# Altium project Body.PrjPcb
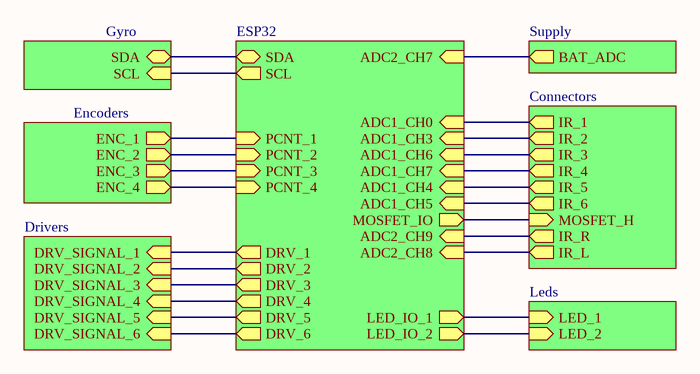
[diagram p0: Body.SchDoc]
8 sheets, 53 parts. Net scope: hierarchical (ports join the sheet entries above them; power ports are global).
Board file: Body.PcbDoc
Sheets:
  Body.SchDoc
    ESP32 = ESP32.SchDoc
    Gyro = Gyro.SchDoc
    Leds = Leds.SchDoc
    Connectors = Connectors.SchDoc
    Supply = Supply.SchDoc
    Drivers = Drivers.SchDoc
    Encoders = Encoders.SchDoc

## Sheet Body.SchDoc
size A4; SheetNumber: 1; SheetTotal: 8

### Sub-sheets
Connectors = Connectors: MOSFET_H (in), IR_1 (out), IR_2 (out), IR_3 (out), IR_4 (out), IR_5 (out), IR_6 (out), IR_R (out), IR_L (out)
Drivers = Drivers: DRV_SIGNAL_1 (in), DRV_SIGNAL_2 (in), DRV_SIGNAL_3 (in), DRV_SIGNAL_4 (in), DRV_SIGNAL_5 (in), DRV_SIGNAL_6 (in)
Encoders = Encoders: ENC_1 (out), ENC_2 (out), ENC_3 (out), ENC_4 (out)
ESP32 = ESP32: ADC1_CH0 (in), ADC1_CH3 (in), ADC1_CH4 (in), ADC1_CH5 (in), ADC1_CH6 (in), ADC1_CH7 (in), MOSFET_IO (out), DRV_1 (out), DRV_2 (out), DRV_3 (out), DRV_4 (out), DRV_5 (out), DRV_6 (out), SCL (out), SDA (bidir), ADC2_CH8 (in), PCNT_1 (in), PCNT_2 (in), PCNT_3 (in), PCNT_4 (in), LED_IO_1 (out), LED_IO_2 (out), ADC2_CH7 (in), ADC2_CH9 (in)
Gyro = Gyro: SDA (bidir), SCL (in)
Leds = Leds: LED_1 (in), LED_2 (in)
Supply = Supply: BAT_ADC (out)

### Nets
SCL: sheet ESP32/SCL, sheet Gyro/SCL
SDA: sheet ESP32/SDA, sheet Gyro/SDA
NetD4_A: sheet ESP32/LED_IO_1, sheet Leds/LED_1
NetD6_A: sheet ESP32/LED_IO_2, sheet Leds/LED_2
NetJ1_3: sheet ESP32/ADC1_CH5, sheet Connectors/IR_6
NetJ1_4: sheet ESP32/ADC1_CH4, sheet Connectors/IR_5
NetJ1_5: sheet ESP32/ADC1_CH7, sheet Connectors/IR_4
NetJ1_6: sheet ESP32/ADC1_CH6, sheet Connectors/IR_3
NetJ1_7: sheet ESP32/ADC1_CH3, sheet Connectors/IR_2
NetJ1_8: sheet ESP32/ADC1_CH0, sheet Connectors/IR_1
NetJ2_3: sheet ESP32/ADC2_CH8, sheet Connectors/IR_L
NetJ3_3: sheet ESP32/ADC2_CH9, sheet Connectors/IR_R
NetJ7_PIN1: sheet ESP32/DRV_4, sheet Drivers/DRV_SIGNAL_4
NetJ8_PIN1: sheet ESP32/DRV_1, sheet Drivers/DRV_SIGNAL_1
NetJ9_PIN1: sheet ESP32/DRV_5, sheet Drivers/DRV_SIGNAL_5
NetJ10_PIN1: sheet ESP32/DRV_2, sheet Drivers/DRV_SIGNAL_2
NetJ11_PIN1: sheet ESP32/DRV_6, sheet Drivers/DRV_SIGNAL_6
NetJ12_PIN1: sheet ESP32/DRV_3, sheet Drivers/DRV_SIGNAL_3
NetR1_1: sheet ESP32/MOSFET_IO, sheet Connectors/MOSFET_H
NetR3_1: sheet ESP32/ADC2_CH7, sheet Supply/BAT_ADC
NetR15_1: sheet ESP32/PCNT_1, sheet Encoders/ENC_1
NetR16_1: sheet ESP32/PCNT_2, sheet Encoders/ENC_2
NetR17_1: sheet ESP32/PCNT_3, sheet Encoders/ENC_3
NetR18_1: sheet ESP32/PCNT_4, sheet Encoders/ENC_4

## Sheet ESP32.SchDoc
size A4; SheetNumber: 5; SheetTotal: 8
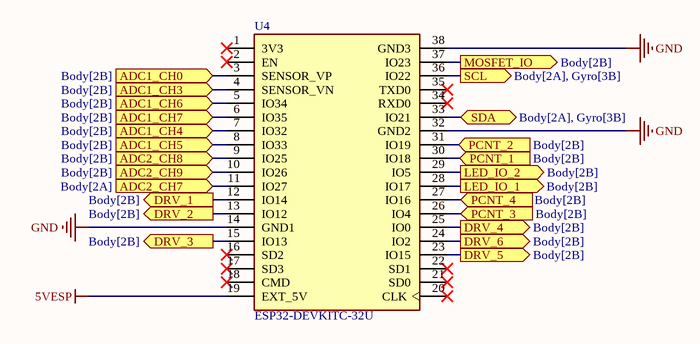
[diagram p1: ESP32.SchDoc]

### Parts
U4  ESP32-DEVKITC-32U  [MODULE_ESP32-DEVKITC-32U]

### Ports
ADC1_CH0 (in, see Body[2B]), ADC1_CH3 (in, see Body[2B]), ADC1_CH4 (in, see Body[2B]), ADC1_CH5 (in, see Body[2B]), ADC1_CH6 (in, see Body[2B]), ADC1_CH7 (in, see Body[2B]), ADC2_CH7 (in, see Body[2A]), ADC2_CH8 (in, see Body[2B]), ADC2_CH9 (in, see Body[2B]), DRV_1 (out, see Body[2B]), DRV_2 (out, see Body[2B]), DRV_3 (out, see Body[2B]), DRV_4 (out, see Body[2B]), DRV_5 (out, see Body[2B]), DRV_6 (out, see Body[2B]), LED_IO_1 (out, see Body[2B]), LED_IO_2 (out, see Body[2B]), MOSFET_IO (out, see Body[2B]), PCNT_1 (in, see Body[2B]), PCNT_2 (in, see Body[2B]), PCNT_3 (in, see Body[2B]), PCNT_4 (in, see Body[2B]), SCL (out, see Body[2A], Gyro[3B]), SDA (bidir, see Body[2A], Gyro[3B])

### Nets
5VESP: U4.19(EXT_5V)
GND: U4.14(GND1) U4.32(GND2) U4.38(GND3)
SCL: U4.36(IO22) ; port SCL
SDA: U4.33(IO21) ; port SDA
NetD4_A: U4.28(IO17) ; port LED_IO_1
NetD6_A: U4.29(IO5) ; port LED_IO_2
NetJ1_3: U4.8(IO33) ; port ADC1_CH5
NetJ1_4: U4.7(IO32) ; port ADC1_CH4
NetJ1_5: U4.6(IO35) ; port ADC1_CH7
NetJ1_6: U4.5(IO34) ; port ADC1_CH6
NetJ1_7: U4.4(SENSOR_VN) ; port ADC1_CH3
NetJ1_8: U4.3(SENSOR_VP) ; port ADC1_CH0
NetJ2_3: U4.9(IO25) ; port ADC2_CH8
NetJ3_3: U4.10(IO26) ; port ADC2_CH9
NetJ7_PIN1: U4.25(IO0) ; port DRV_4
NetJ8_PIN1: U4.12(IO14) ; port DRV_1
NetJ9_PIN1: U4.23(IO15) ; port DRV_5
NetJ10_PIN1: U4.13(IO12) ; port DRV_2
NetJ11_PIN1: U4.24(IO2) ; port DRV_6
NetJ12_PIN1: U4.15(IO13) ; port DRV_3
NetR1_1: U4.37(IO23) ; port MOSFET_IO
NetR3_1: U4.11(IO27) ; port ADC2_CH7
NetR15_1: U4.30(IO18) ; port PCNT_1
NetR16_1: U4.31(IO19) ; port PCNT_2
NetR17_1: U4.26(IO4) ; port PCNT_3
NetR18_1: U4.27(IO16) ; port PCNT_4

Not connected (* = marked no-connect by the designer): U4 1(3V3)* 2(EN)* 16(SD2)* 17(SD3)* 18(CMD)* 20(CLK)* 21(SD0)* 22(SD1)* 34(RXD0)* 35(TXD0)*

### Library data of the parts
U4 = ESP32-DEVKITC-32U: ESP32-WROOM-32UE series Transceiver; 802.11 b/g/n (Wi-Fi, WiFi, WLAN), Bluetooth® Smart Ready 4.x Dual Mode Evaluation Board; MF: Espressif Systems; SnapEDA_Link: https://www.snapeda.com/parts/ESP32-DEVKITC-32U/Espressif+Systems/view-part/?ref=snap; Package: CUSTOM-38 ESPRESSIF; Value: *; MP: ESP32-DEVKITC-32U; Check_prices: https://www.snapeda.com/parts/ESP32-DEVKITC-32U/Espressif+Systems/view-part/?ref=eda

## Sheet Gyro.SchDoc
size A4 portrait; SheetNumber: 6; SheetTotal: 8
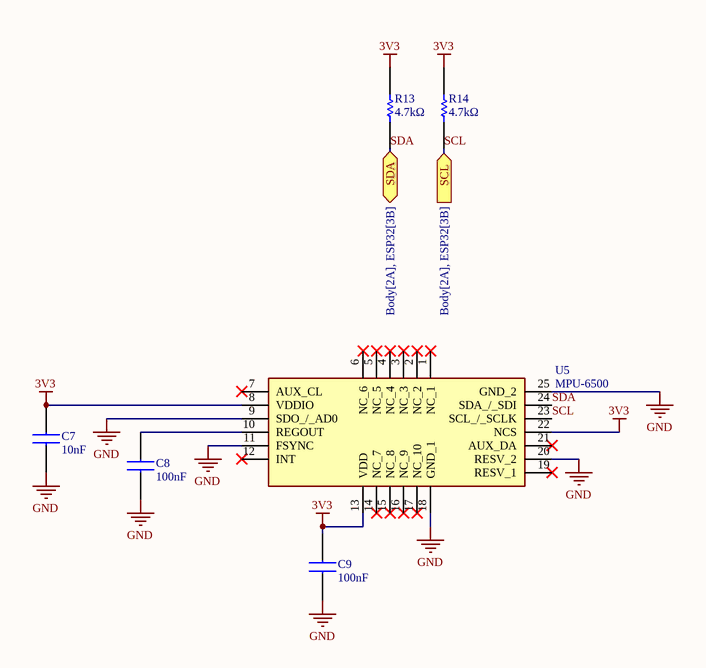
[diagram p2: Gyro.SchDoc]

### Parts
C7  value 10nF  [CAP0805]  (hidden comment: CL21B103KBANNNC)
C8  value 100nF  [CAP0805]  (hidden comment: CC0805KRX7R9BB104)
C9  value 100nF  [CAP0805]  (hidden comment: CC0805KRX7R9BB104)
R13  value 4.7kΩ  [RES0805]  (hidden comment: 0805W8F4701T5E)
R14  value 4.7kΩ  [RES0805]  (hidden comment: 0805W8F4701T5E)
U5  MPU-6500  [QFN-24_L3.0-W3.0-H0.9]

### Ports
SCL (in, see Body[2A], ESP32[3B]), SDA (bidir, see Body[2A], ESP32[3B])

### Nets
3V3: C7.1 C9.1 R13.2 R14.2 U5.8(VDDIO) U5.13(VDD) U5.22(NCS)
GND: C7.2 C8.1 C9.2 U5.9(SDO_/_AD0) U5.11(FSYNC) U5.18(GND_1) U5.20(RESV_2) U5.25(GND_2)
SCL: R14.1 U5.23(SCL_/_SCLK) ; port SCL
SDA: R13.1 U5.24(SDA_/_SDI) ; port SDA
NetC8_2: C8.2 U5.10(REGOUT)

Not connected (* = marked no-connect by the designer): U5 1(NC_1)* 2(NC_2)* 3(NC_3)* 4(NC_4)* 5(NC_5)* 6(NC_6)* 7(AUX_CL)* 12(INT)* 14(NC_7)* 15(NC_8)* 16(NC_9)* 17(NC_10)* 19(RESV_1)* 21(AUX_DA)*

### Library data of the parts
C7 = CL21B103KBANNNC: Multilayer Ceramic Capacitors MLCC - SMD/SMT 50 V 10nF X7R 0805 10%; Manufacturer_Name: YAGEO; Geometry.Height: 0.95mm; Manufacturer_Part_Number: CL21B103KBANNNC; Datasheet Link: https://wmsc.lcsc.com/wmsc/upload/file/pdf/v2/lcsc/2304140030_Samsung-Electro-Mechanics-CL21B103KBANNNC_C1710.pdf; LCSC: C1710
C8 C9 = CC0805KRX7R9BB104: Multilayer Ceramic Capacitors MLCC - SMD/SMT 50 V 0.1uF X7R 0805 10%; Manufacturer_Name: YAGEO; Geometry.Height: 0.95mm; Mouser Part Number: 603-CC805KRX7R9BB104; Mouser Price/Stock: https://www.mouser.co.uk/ProductDetail/YAGEO/CC0805KRX7R9BB104?qs=vTakOoo5QyLx0lXWgVtRhQ%3D%3D; Manufacturer_Part_Number: CC0805KRX7R9BB104; Datasheet Link: https://www.yageo.com/upload/media/product/productsearch/datasheet/mlcc/UPY-GPHC_X7R_6.3V-to-50V_20.pdf; LCSC: C49678
R13 R14 = 0805W8F4701T5E: 125mW Thick Film Resistors 150V ±100ppm/℃ ±1% 4.7kΩ 0805 Chip Resistor - Surface Mount ROHS; Manufacturer_Name: UNI-ROYAL; Geometry.Height: 0.95mm; Manufacturer_Part_Number: 0805W8F4701T5E; Datasheet Link: https://wmsc.lcsc.com/wmsc/upload/file/pdf/v2/lcsc/2206010200_UNI-ROYAL-Uniroyal-Elec-0805W8F4701T5E_C17673.pdf; LCSC: C17673
U5 = MPU-6500: IMUs - Inertial Measurement Units 6-Axis MEMS MotionTracking  Device with DMP; Manufacturer_Name: TDK; Geometry.Height: 0.95mm; LCSC: C50278; Part Number: MPU-6500; ComponentLink1Description: New link; ComponentLink1URL: https://product.tdk.com/system/files/dam/doc/product/sensor/mortion-inertial/imu/data_sheet/mpu-6500-datasheet2.pdf

## Sheet Leds.SchDoc
size A4 portrait; SheetNumber: 7; SheetTotal: 8
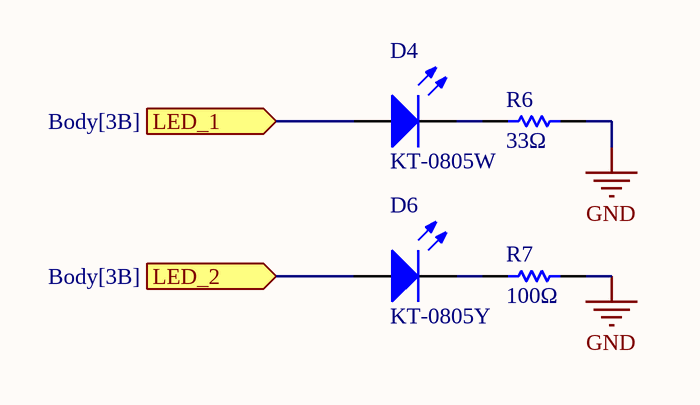
[diagram p3: Leds.SchDoc]

### Parts
D4  KT-0805W  [LED0805]
D6  KT-0805Y  [LED0805]
R6  value 33Ω  [RES0805]  (hidden comment: 0805W8F330JT5E)
R7  value 100Ω  [RES0805]  (hidden comment: 0805W8F1000T5E)

### Ports
LED_1 (in, see Body[3B]), LED_2 (in, see Body[3B])

### Nets
GND: R6.2 R7.2
NetD4_A: D4.A ; port LED_1
NetD4_K: D4.K R6.1
NetD6_A: D6.A ; port LED_2
NetD6_K: D6.K R7.1

### Library data of the parts
D4 = KT-0805W: 0805 LED Indication - Discrete ROHS; Manufacturer: Hubei KENTO Elec; Color: White; Current - Forward (If): 25mA; Voltage - Forward (Vf): 2.8V; LCSC: C34499; Package / Case: 0805; ComponentLink2Description: Datasheet; ComponentLink2URL: https://www.lcsc.com/datasheet/lcsc_datasheet_2305091500_Hubei-KENTO-Elec-KT-0805W_C34499.pdf; ComponentLink3Description: JLCPCB; ComponentLink3URL: https://jlcpcb.com/partdetail/Hubei_KentoElec-KT0805W/C34499
D6 = KT-0805Y: Yellow 0805 LED Indication - Discrete ROHS; Manufacturer: Hubei KENTO Elec; Current - Forward (If): 20mA; Voltage - Forward (Vf): 2.1V; LCSC: C2296; Package / Case: 0805; Color: Yellow; ComponentLink2Description: Datasheet; ComponentLink2URL: https://www.lcsc.com/datasheet/lcsc_datasheet_1806151129_Hubei-KENTO-Elec-KT-0805Y_C2296.pdf
R6 = 0805W8F330JT5E: 125mW Thick Film Resistors 150V ±1% ±200ppm/℃ 33Ω 0805 Chip Resistor - Surface Mount ROHS; Manufacturer_Name: UNI-ROYAL; Geometry.Height: 0.95mm; Part Number: 0805W8F330JT5E; LCSC: C17634; ComponentLink1Description: Datasheet Link; ComponentLink1URL: https://www.lcsc.com/datasheet/lcsc_datasheet_2205311830_UNI-ROYAL-Uniroyal-Elec-0805W8F330JT5E_C17634.pdf
R7 = 0805W8F1000T5E: 125mW Thick Film Resistors 150V ±100ppm/℃ ±1% 100Ω 0805 Chip Resistor - Surface Mount ROHS; Manufacturer_Name: UNI-ROYAL; Geometry.Height: 0.95mm; Manufacturer_Part_Number: 0805W8F1000T5E; Datasheet Link: https://wmsc.lcsc.com/wmsc/upload/file/pdf/v2/lcsc/2206010216_UNI-ROYAL-Uniroyal-Elec-0805W8F1000T5E_C17408.pdf; LCSC: C17408

## Sheet Connectors.SchDoc
size A4 portrait; SheetNumber: 2; SheetTotal: 8
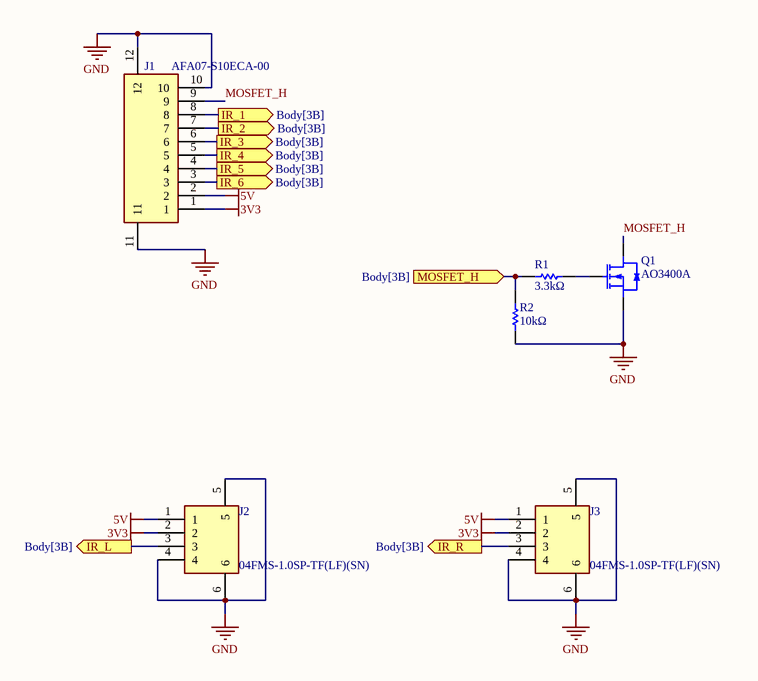
[diagram p4: Connectors.SchDoc]

### Parts
J1  AFA07-S10ECA-00  [FPC-SMD-P1.00-10P_LCS-SJ-H2.5]
J2  04FMS-1.0SP-TF(LF)(SN)  [FPC-SMD-P1.00-4P_JST]
J3  04FMS-1.0SP-TF(LF)(SN)  [FPC-SMD-P1.00-4P_JST]
Q1  AO3400A  [SOT-23]
R1  value 3.3kΩ  [RES0805]  (hidden comment: 0805W8F3301T5E)
R2  value 10kΩ  [RES0805]  (hidden comment: 0805W8F1002T5E)

### Ports
IR_1 (out, see Body[3B]), IR_2 (out, see Body[3B]), IR_3 (out, see Body[3B]), IR_4 (out, see Body[3B]), IR_5 (out, see Body[3B]), IR_6 (out, see Body[3B]), IR_L (out, see Body[3B]), IR_R (out, see Body[3B]), MOSFET_H (in, see Body[3B])

### Nets
3V3: J1.1 J2.2 J3.2
5V: J1.2 J2.1 J3.1
GND: J1.10 J1.11 J1.12 J2.4 J2.5 J2.6 J3.4 J3.5 J3.6 Q1.S R2.1
MOSFET_H: J1.9 Q1.D
NetJ1_3: J1.3 ; port IR_6
NetJ1_4: J1.4 ; port IR_5
NetJ1_5: J1.5 ; port IR_4
NetJ1_6: J1.6 ; port IR_3
NetJ1_7: J1.7 ; port IR_2
NetJ1_8: J1.8 ; port IR_1
NetJ2_3: J2.3 ; port IR_L
NetJ3_3: J3.3 ; port IR_R
NetQ1_G: Q1.G R1.2
NetR1_1: R1.1 R2.2 ; port MOSFET_H

### Library data of the parts
J1 = AFA07-S10ECA-00: Drawer Type 10P Contact,Top Horizontal attachment 1mm SMD,P=1mm,Surface Mount，Right Angle FFC, FPC (Flat Flexible) Connector Assemblies ROHS; Manufacturer_Name: JUSHUO; Geometry.Height: 2.50mm; Manufacturer_Part_Number: AFA07-S10ECA-00; Datasheet Link: https://wmsc.lcsc.com/wmsc/upload/file/pdf/v2/lcsc/2304140030_JUSHUO-AFA07-S10ECA-00_C262737.pdf; LCSC: C262737
J2 J3 = 04FMS-1.0SP-TF(LF)(SN): Drawer Type 4P Dual-sided contacts / top and bottom connection Horizontal attachment 1mm SMD,P=1mm,Surface Mount，Right Angle FFC, FPC (Flat Flexible) Connector Assemblies ROHS; Manufacturer_Name: JST; Geometry.Height: 2.80mm; Manufacturer_Part_Number: 04FMS-1.0SP-TF(LF)(SN); LCSC: C265033; ComponentLink1Description: JLCPCB; ComponentLink1URL: https://jlcpcb.com/partdetail/Jst-04FMS_1_0SP_TF_LF_SN/C265033; ComponentLink2Description: Datasheet; ComponentLink2URL: https://www.lcsc.com/datasheet/lcsc_datasheet_1811061308_JST-04FMS-1-0SP-TF-LF-SN_C265033.pdf
Q1 = AO3400A: 30V 5.7A 26.5mΩ@10V,5.7A 1.4W 1.5V@250uA 1PCSNChannel SOT-23-3L MOSFETs ROHS; Manufacturer: Alpha & Omega Semicon; FET Type: N-Channel; Rds On (Max) @ Id, Vgs: 38 mohm @ 5.7A, 10V; Input Capacitance (Ciss) (Max) @Vds: 630pF; Vgs(th) (Max) Id: 1.5V, Id =250uA; Gate Charge (Qg) (Max) @ Vgs: 7nC @ 4.5V; Vgs (Max): 12 V; Rise / Fall Time (Typ): 2.5 ~ 2.0 (ns); Part Number: AO3400A; Package / Case: SOT-23; Operating Temperature: -55 °C ~150 °C; Drain to Source Voltage (Vds): 30V; Current - Continuous Drain (Id) @25°C: 5.7A; Power Dissipation (Max): 1.4 W; ComponentLink1Description: Datasheet; ComponentLink1URL: https://jlcpcb.com/partdetail/Alpha_OmegaSemicon-AO3400A/C20917; LCSC: C20917
R1 = 0805W8F3301T5E: 125mW Thick Film Resistors 150V ±100ppm/℃ ±1% 3.3kΩ 0805 Chip Resistor - Surface Mount ROHS; Manufacturer_Name: UNI-ROYAL; Geometry.Height: 0.95mm; Manufacturer_Part_Number: 0805W8F3301T5E; Datasheet Link: https://wmsc.lcsc.com/wmsc/upload/file/pdf/v2/lcsc/2206010045_UNI-ROYAL-Uniroyal-Elec-0805W8F3301T5E_C26010.pdf; LCSC: C26010
R2 = 0805W8F1002T5E: 125mW Thick Film Resistors 150V ±100ppm/℃ ±1% 10kΩ 0805 Chip Resistor - Surface Mount ROHS; Manufacturer_Name: UNI-ROYAL; Geometry.Height: 0.95mm; Manufacturer_Part_Number: 0805W8F1002T5E; Datasheet Link: https://wmsc.lcsc.com/wmsc/upload/file/pdf/v2/lcsc/2206010216_UNI-ROYAL-Uniroyal-Elec-0805W8F1002T5E_C17414.pdf; LCSC: C17414

## Sheet Supply.SchDoc
size A4; SheetNumber: 8; SheetTotal: 8
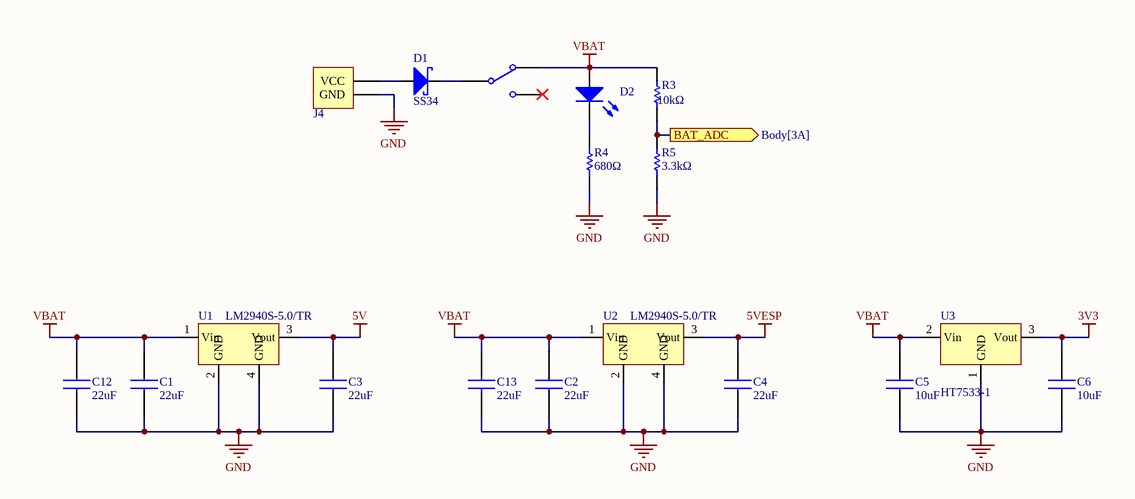
[diagram p5: Supply.SchDoc]

### Parts
C1  value 22uF  [CAP0805]  (hidden comment: CL21A226MAQNNNE)
C2  value 22uF  [CAP0805]  (hidden comment: CL21A226MAQNNNE)
C3  value 22uF  [CAP0805]  (hidden comment: CL21A226MAQNNNE)
C4  value 22uF  [CAP0805]  (hidden comment: CL21A226MAQNNNE)
C5  value 10uF  [CAP0805]  (hidden comment: GRM21BR61H106KE43L)
C6  value 10uF  [CAP0805]  (hidden comment: GRM21BR61H106KE43L)
C12  value 22uF  [CAP0805]  (hidden comment: CL21A226MAQNNNE)
C13  value 22uF  [CAP0805]  (hidden comment: CL21A226MAQNNNE)
D1  SS34  [SMA_L4.3-W2.6-LS5.2-RD]
D2  KT-0805G  [LED0805]  (value not drawn)
J4  BATTERY  [XT30]  (value not drawn)
R3  value 10kΩ  [RES0805]  (hidden comment: 0805W8F1002T5E)
R4  value 680Ω  [RES0805]  (hidden comment: 0805W8F6800T5E)
R5  value 3.3kΩ  [RES0805]  (hidden comment: 0805W8F3301T5E)
SW1  SS12D10G4 071  [SW-TH_SHOU-HAN_SS12D10G4]  (value not drawn)
U1  LM2940S-5.0/TR  [TO-263-3_L8.6-W10.2-P2.54-LS14.4-BR]
U2  LM2940S-5.0/TR  [TO-263-3_L8.6-W10.2-P2.54-LS14.4-BR]
U3  HT7533-1  [SOT-89-3_L4.5-W2.5-P1.50-LS4.2-BR]

### Ports
BAT_ADC (out, see Body[3A])

### Nets
3V3: C6.2 U3.3(Vout)
5V: C3.2 U1.3(Vout)
5VESP: C4.2 U2.3(Vout)
GND: C1.1 C2.1 C3.1 C4.1 C5.1 C6.1 C12.1 C13.1 J4.2(GND) R4.1 R5.1 U1.2(GND) U1.4(GND) U2.2(GND) U2.4(GND) U3.1(GND)
VBAT: C1.2 C2.2 C5.2 C12.2 C13.2 D2.A R3.2 SW1.1 U1.1(Vin) U2.1(Vin) U3.2(Vin)
NetD1_A: D1.A J4.1(VCC)
NetD1_C: D1.C SW1.2(COMMON)
NetD2_K: D2.K R4.2
NetR3_1: R3.1 R5.2 ; port BAT_ADC

Not connected (* = marked no-connect by the designer): SW1 3(NO)*

### Library data of the parts
C1-C4 C12 C13 = CL21A226MAQNNNE: 25V 22uF X5R ±20% 0805 Multilayer Ceramic Capacitors MLCC - SMD/SMT ROHS; Manufacturer_Name: Samsung Electro-Mechanics; Geometry.Height: 0.95mm; Manufacturer_Part_Number: CL21A226MAQNNNE; LCSC: C45783; ComponentLink1Description: JLCPCB; ComponentLink1URL: https://jlcpcb.com/partdetail/46786-CL21A226MAQNNNE/C45783; ComponentLink2Description: Datasheet; ComponentLink2URL: https://www.lcsc.com/datasheet/lcsc_datasheet_2304140030_Samsung-Electro-Mechanics-CL21A226MAQNNNE_C45783.pdf
C5 C6 = GRM21BR61H106KE43L: 50V 10uF X5R ±10% 0805 Multilayer Ceramic Capacitors MLCC - SMD/SMT ROHS; Manufacturer: Murata Electronics; Geometry.Height: 0.95mm; Part Number: GRM21BR61H106KE43L; LCSC: C440198; ComponentLink1Description: Datasheet; ComponentLink1URL: https://www.lcsc.com/datasheet/lcsc_datasheet_2310251059_Murata-Electronics-GRM21BR61H106KE43L_C440198.pdf; ComponentLink2Description: JLCPCB; ComponentLink2URL: https://jlcpcb.com/partdetail/439567-GRM21BR61H106KE43L/C440198; Rated Voltage: 50V
D1 = SS34: 40V Independent Type 3A 550mV@3A SMA(DO-214AC) Schottky Diodes ROHS; Manufacturer: MDD(Microdiode Semiconductor); Max Forward Surge Current (Ifsm): 80 A; Current - Reverse Leakage @ Vr: 500 mA; Voltage - Forward (Vf) (Max) @ If: 550 mV; Diode Type: Schottky Barrier Rectifier; Part Number: SS34; Category: Schottky Diodes & Rectifiers; Package / Case: SMA(DO-214AC); Current - Average Rectified (Io): 3 A; Operating Temperature: - 55ºC ~ 125ºC; Voltage - DC Reverse (Vr) (Max): 40 V; ComponentLink1Description: JLCPCB; ComponentLink1URL: https://jlcpcb.com/partdetail/mdd_microdiode_semiconductor-SS34/C8678; ComponentLink2Description: Datasheet; ComponentLink2URL: https://www.lcsc.com/datasheet/lcsc_datasheet_2407101107_MDD-Microdiode-Semiconductor-SS34_C8678.pdf; LCSC: C8678
D2 = KT-0805G: Emerald 0805 LED Indication - Discrete ROHS; Manufacturer: Hubei KENTO Elec; Color: Green; Current - Forward (If): 20mA; Voltage - Forward (Vf): 2.6V; LCSC: C2297; Package / Case: 0805; ComponentLink2Description: Datasheet; ComponentLink2URL: https://www.lcsc.com/datasheet/lcsc_datasheet_1806151129_Hubei-KENTO-Elec-KT-0805Y_C2296.pdf
J4 = XT30: CONN BATTERY HORZ 2POS XT30; Library Control - Checked Footprint: Under review; Library Control - Checked Schematic: Yes; Library Control - Last Project that Used: Follow-Final; Library Control - Person that Checked Footprint: Lucas; Library Control - Person that did the Last Update Footprint: Mateus(Dimas); Library Control - Last Update: 24/04/2021 00:25; Library Control - Person that Checked Schematic: Lucas; Library Control - Person that did the Last Update Schematic: Mateus(Dimas); ComponentLink1Description: Supplier Link; ComponentLink1URL: https://www.gobilda.com/right-angle-pcb-mount-xt30-connector-mh-fc-2-pack/
R3 = 0805W8F1002T5E: as R2 on sheet Connectors; Manufacturer_Part_Number: 0805W8F1002T5E; Datasheet Link: https://wmsc.lcsc.com/wmsc/upload/file/pdf/v2/lcsc/2206010216_UNI-ROYAL-Uniroyal-Elec-0805W8F1002T5E_C17414.pdf; LCSC: C17414
R4 = 0805W8F6800T5E: 125mW Thick Film Resistors 150V ±100ppm/℃ ±1% 680Ω 0805 Chip Resistor - Surface Mount ROHS; Manufacturer_Name: UNI-ROYAL; Geometry.Height: 0.95mm; Part Number: 0805W8F6800T5E; LCSC: C17798; ComponentLink1Description: Datasheet Link; ComponentLink1URL: https://www.lcsc.com/datasheet/lcsc_datasheet_2205311830_UNI-ROYAL-Uniroyal-Elec-0805W8F6800T5E_C17798.pdf
R5 = 0805W8F3301T5E: as R1 on sheet Connectors; Manufacturer_Part_Number: 0805W8F3301T5E; Datasheet Link: https://wmsc.lcsc.com/wmsc/upload/file/pdf/v2/lcsc/2206010045_UNI-ROYAL-Uniroyal-Elec-0805W8F3301T5E_C26010.pdf; LCSC: C26010
SW1 = SS12D10G4 071: Manufacturer: SHOU HAN(首韩); Add into BOM: yes; Circuit: SPDT; Pin Style: PCPin; Switch Length: 12.7mm; Switch Width: 6.7mm; Switch Height: 6.4mm; Current Rating (DC): 2A; Voltage Rating (DC): 125V; Mechanical Life: 3千次; Symbol: SS12D10G4 071; Device: SS12D10G4 071; LCSC Part Name: SS12D10G4 071; LCSC: C2887259; Manufacturer Part: SS12D10G4 071; Supplier Footprint: 插件; JLCPCB Part Class: Extended Part; Datasheet: https://atta.szlcsc.com/upload/public/pdf/source/20210820/80D1704BBF3FCEE0435FCAA54C61E0A3.pdf; Supplier: LCSC; Convert to PCB: yes; Actuator Style: -; Mounting Style: Straight; Actuator Color: -; Current Rating (AC): -; Voltage Rating (AC): -; Operating Temperature: -16℃~+60℃
U1 U2 = LM2940S-5.0/TR: 1A 60dB@(120Hz) Fixed 5V Positive electrode 26V TO-263-3L Voltage Regulators - Linear, Low Drop Out (LDO) Regulators ROHS; Manufacturer: HGSEMI; Voltage - Dropout (Max): 21 V; Part Number: LM2940S-5.0/TR; Package/ Case: TO-263-3; Operating Temperature: 0~125 ºC; Output Type: Fixed; Voltage - Input (Max): 26 V; Voltage - Output (Min/Fixed): 5 V; LCSC: C434496; Current - Output: 1 A; ComponentLink2Description: Datasheet; ComponentLink2URL: https://www.lcsc.com/datasheet/lcsc_datasheet_2201242200_HGSEMI-LM2940S-5-0-TR_C434496.pdf; ComponentLink3Description: JLCPCB; ComponentLink3URL: https://jlcpcb.com/partdetail/Hgsemi-LM2940S_5_0TR/C434496
U3 = HT7533-1: 100mA Fixed 3.3V Positive electrode 30V SOT-89-3 Voltage Regulators - Linear, Low Drop Out (LDO) Regulators ROHS; Manufacturer: Holtek Semicon; Max Power Dissipation: 500 mW; Current - Quiescent (Iq): 8mA; Voltage - Dropout (Max): 26.7 V; Part Number: HT7533-1; Package/ Case: SOT-89-3; Operating Temperature: -40~85 ºC; Output Type: Fixed; Voltage - Input (Max): 30 V; Voltage - Output (Min/Fixed): 3.3 V; LCSC: C14289; Current - Output: 100 mA; ComponentLink2Description: Datasheet; ComponentLink2URL: https://www.lcsc.com/datasheet/lcsc_datasheet_2312191111_Holtek-Semicon-HT7533-1_C14289.pdf; ComponentLink3Description: JLCPCB; ComponentLink3URL: https://jlcpcb.com/partdetail/HoltekSemicon-HT75331/C14289

## Sheet Drivers.SchDoc
size A4; SheetNumber: 3; SheetTotal: 8
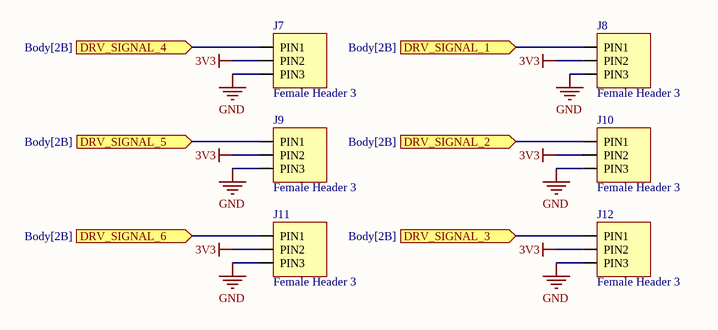
[diagram p6: Drivers.SchDoc]

### Parts
J7  Female Header 3  [FEMALE HEADER 3]
J8  Female Header 3  [FEMALE HEADER 3]
J9  Female Header 3  [FEMALE HEADER 3]
J10  Female Header 3  [FEMALE HEADER 3]
J11  Female Header 3  [FEMALE HEADER 3]
J12  Female Header 3  [FEMALE HEADER 3]

### Ports
DRV_SIGNAL_1 (in, see Body[2B]), DRV_SIGNAL_2 (in, see Body[2B]), DRV_SIGNAL_3 (in, see Body[2B]), DRV_SIGNAL_4 (in, see Body[2B]), DRV_SIGNAL_5 (in, see Body[2B]), DRV_SIGNAL_6 (in, see Body[2B])

### Nets
3V3: J7.PIN2 J8.PIN2 J9.PIN2 J10.PIN2 J11.PIN2 J12.PIN2
GND: J7.PIN3 J8.PIN3 J9.PIN3 J10.PIN3 J11.PIN3 J12.PIN3
NetJ7_PIN1: J7.PIN1 ; port DRV_SIGNAL_4
NetJ8_PIN1: J8.PIN1 ; port DRV_SIGNAL_1
NetJ9_PIN1: J9.PIN1 ; port DRV_SIGNAL_5
NetJ10_PIN1: J10.PIN1 ; port DRV_SIGNAL_2
NetJ11_PIN1: J11.PIN1 ; port DRV_SIGNAL_6
NetJ12_PIN1: J12.PIN1 ; port DRV_SIGNAL_3

### Library data of the parts
J7-J12 = Female Header 3: Number of Contacts: 3; System: Connector

## Sheet Encoders.SchDoc
size A4; SheetNumber: 4; SheetTotal: 8
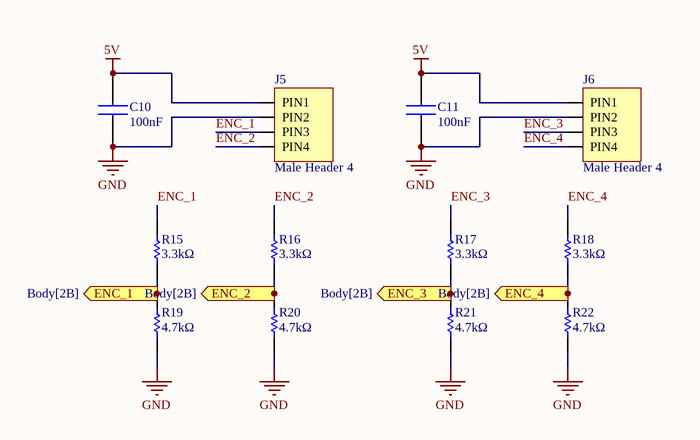
[diagram p7: Encoders.SchDoc]

### Parts
C10  value 100nF  [CAP0805]  (hidden comment: CC0805KRX7R9BB104)
C11  value 100nF  [CAP0805]  (hidden comment: CC0805KRX7R9BB104)
J5  Male Header 4  [MALE HEADER 4]
J6  Male Header 4  [MALE HEADER 4]
R15  value 3.3kΩ  [RES0805]  (hidden comment: 0805W8F3301T5E)
R16  value 3.3kΩ  [RES0805]  (hidden comment: 0805W8F3301T5E)
R17  value 3.3kΩ  [RES0805]  (hidden comment: 0805W8F3301T5E)
R18  value 3.3kΩ  [RES0805]  (hidden comment: 0805W8F3301T5E)
R19  value 4.7kΩ  [RES0805]  (hidden comment: 0805W8F4701T5E)
R20  value 4.7kΩ  [RES0805]  (hidden comment: 0805W8F4701T5E)
R21  value 4.7kΩ  [RES0805]  (hidden comment: 0805W8F4701T5E)
R22  value 4.7kΩ  [RES0805]  (hidden comment: 0805W8F4701T5E)

### Ports
ENC_1 (out, see Body[2B]), ENC_2 (out, see Body[2B]), ENC_3 (out, see Body[2B]), ENC_4 (out, see Body[2B])

### Nets
5V: C10.1 C11.1 J5.PIN1 J6.PIN1
GND: C10.2 C11.2 J5.PIN2 J6.PIN2 R19.1 R20.1 R21.1 R22.1
ENC_1: J5.PIN3 R15.2
ENC_2: J5.PIN4 R16.2
ENC_3: J6.PIN3 R17.2
ENC_4: J6.PIN4 R18.2
NetR15_1: R15.1 R19.2 ; port ENC_1
NetR16_1: R16.1 R20.2 ; port ENC_2
NetR17_1: R17.1 R21.2 ; port ENC_3
NetR18_1: R18.1 R22.2 ; port ENC_4

### Library data of the parts
C10 C11 = CC0805KRX7R9BB104: as C8 on sheet Gyro; Manufacturer_Part_Number: CC0805KRX7R9BB104; Datasheet Link: https://www.yageo.com/upload/media/product/productsearch/datasheet/mlcc/UPY-GPHC_X7R_6.3V-to-50V_20.pdf; LCSC: C49678
J5 J6 = Male Header 4: Number of Contacts: 4; Library Ref: Header
R15-R18 = 0805W8F3301T5E: as R1 on sheet Connectors; Manufacturer_Part_Number: 0805W8F3301T5E; Datasheet Link: https://wmsc.lcsc.com/wmsc/upload/file/pdf/v2/lcsc/2206010045_UNI-ROYAL-Uniroyal-Elec-0805W8F3301T5E_C26010.pdf; LCSC: C26010
R19-R22 = 0805W8F4701T5E: as R13 on sheet Gyro; Manufacturer_Part_Number: 0805W8F4701T5E; Datasheet Link: https://wmsc.lcsc.com/wmsc/upload/file/pdf/v2/lcsc/2206010200_UNI-ROYAL-Uniroyal-Elec-0805W8F4701T5E_C17673.pdf; LCSC: C17673

## Nets that join several sheets
3V3: Gyro (7 pins), Connectors (J1.1 J2.2 J3.2), Supply (C6.2 U3.3), Drivers (6 pins)
5V: Connectors (J1.2 J2.1 J3.1), Supply (C3.2 U1.3), Encoders (C10.1 C11.1 J5.PIN1 J6.PIN1)
5VESP: ESP32 (U4.19), Supply (C4.2 U2.3)
GND: ESP32 (U4.14 U4.32 U4.38), Gyro (8 pins), Leds (R6.2 R7.2), Connectors (11 pins), Supply (16 pins), Drivers (6 pins), Encoders (8 pins)
NetD4_A: ESP32 (U4.28), Leds (D4.A)
NetD6_A: ESP32 (U4.29), Leds (D6.A)
NetJ1_3: ESP32 (U4.8), Connectors (J1.3)
NetJ1_4: ESP32 (U4.7), Connectors (J1.4)
NetJ1_5: ESP32 (U4.6), Connectors (J1.5)
NetJ1_6: ESP32 (U4.5), Connectors (J1.6)
NetJ1_7: ESP32 (U4.4), Connectors (J1.7)
NetJ1_8: ESP32 (U4.3), Connectors (J1.8)
NetJ2_3: ESP32 (U4.9), Connectors (J2.3)
NetJ3_3: ESP32 (U4.10), Connectors (J3.3)
NetJ7_PIN1: ESP32 (U4.25), Drivers (J7.PIN1)
NetJ8_PIN1: ESP32 (U4.12), Drivers (J8.PIN1)
NetJ9_PIN1: ESP32 (U4.23), Drivers (J9.PIN1)
NetJ10_PIN1: ESP32 (U4.13), Drivers (J10.PIN1)
NetJ11_PIN1: ESP32 (U4.24), Drivers (J11.PIN1)
NetJ12_PIN1: ESP32 (U4.15), Drivers (J12.PIN1)
NetR1_1: ESP32 (U4.37), Connectors (R1.1 R2.2)
NetR3_1: ESP32 (U4.11), Supply (R3.1 R5.2)
NetR15_1: ESP32 (U4.30), Encoders (R15.1 R19.2)
NetR16_1: ESP32 (U4.31), Encoders (R16.1 R20.2)
NetR17_1: ESP32 (U4.26), Encoders (R17.1 R21.2)
NetR18_1: ESP32 (U4.27), Encoders (R18.1 R22.2)
SCL: ESP32 (U4.36), Gyro (R14.1 U5.23)
SDA: ESP32 (U4.33), Gyro (R13.1 U5.24)